# EAGLE design sensorboard1 (EAGLE 9.5.2)
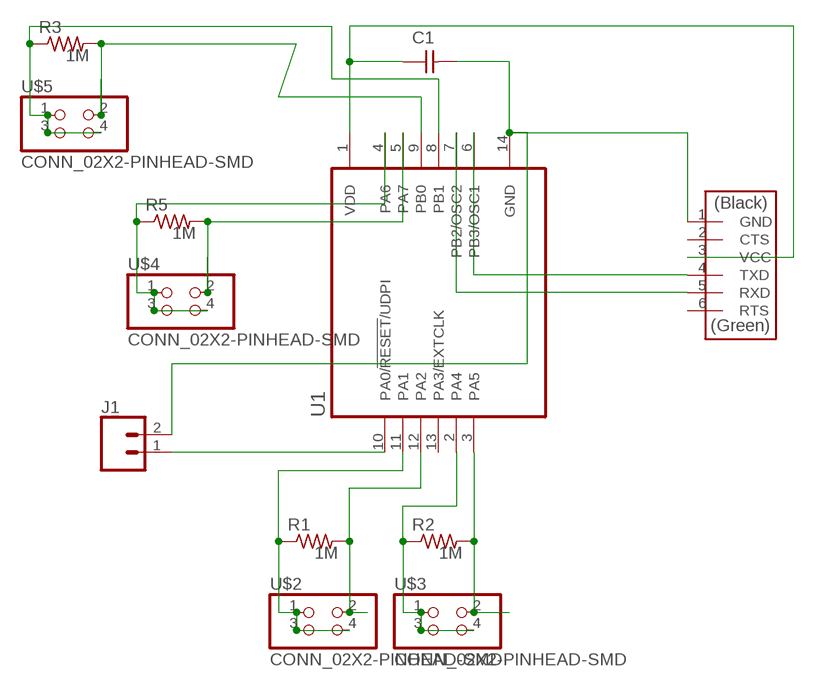
[diagram p0: schematic, sheet 1]

## Parts
C1  CAP_UNPOLARIZEDFAB  [C1206FAB]
J1  CONN_02LOCK_LONGPADS  [1X02_LOCK_LONGPADS]
R1  R1206FAB  [R1206FAB]
R2  R1206FAB  [R1206FAB]
R3  R1206FAB  [R1206FAB]
R5  R1206FAB  [R1206FAB]
U1  ATTINY1614-SSNR  [SOIC127P600X175-14N]
U$1  CONN_06_FTDI-SMD-HEADER  [1X06SMD]
U$2  CONN_02X2-PINHEAD-SMD  [2X02SMD]
U$3  CONN_02X2-PINHEAD-SMD  [2X02SMD]
U$4  CONN_02X2-PINHEAD-SMD  [2X02SMD]
U$5  CONN_02X2-PINHEAD-SMD  [2X02SMD]

## Nets
N$1: R1.2 U1.12(PA2) U$2.2
N$2: R1.1 U1.11(PA1) U$2.1 U$2.3 U$2.4
N$3: R2.2 U1.3(PA5) U$3.2
N$4: R2.1 U1.2(PA4) U$3.1 U$3.3 U$3.4
N$5: R5.2 U1.5(PA7) U$4.2
N$6: R5.1 U1.4(PA6) U$4.1 U$4.3 U$4.4
N$7: C1.2 J1.2 U1.14(GND) U$1.1(GND)
N$8: R3.2 U1.9(PB0) U$5.2
N$9: R3.1 U1.8(PB1) U$5.1 U$5.3 U$5.4
N$11: J1.1 U1.10(PA0/!RESET!/UDPI)
N$12: C1.1 U1.1(VDD) U$1.3(VCC)
N$13: U1.6(PB3/OSC1) U$1.4(TXD)
N$14: U1.7(PB2/OSC2) U$1.5(RXD)
Unconnected: U1.13(PA3/EXTCLK) U$1.2(CTS) U$1.6(RTS)

## Library data of the parts
C1 = fab_new:CAP_UNPOLARIZED
J1 = SparkFun-Connectors:CONN_02: Multi connection point. Often used as Generic Header-pin footprint for 0.1 inch spaced/style header connections On any of the 0.1 inch spaced packages, you can populate with these: Break Away Headers - Straight <https://www.sparkfun.com/products/116> (PRT-00116) Break Away Male Headers - Right Angle <https://www.sparkfun.com/products/553> (PRT-00553) Female Headers <https://www.sparkfun.com/products/115> (PRT-00115) Break Away Headers - Machine Pin <https://www.sparkfun.com/products/117> (PRT-00117) Break Away Female Headers - Swiss Machine Pin <https://www.sparkfun.com/products/743> (PRT-00743) For SCREWTERMINALS and SPRING TERMINALS visit here: Screw Terimnals on SparkFun.com <https://www.sparkfun.com/search/results?term=Screw+Terminals> (5mm/3.5mm/2.54mm spacing) This device is also useful as a general connection point to wire up your design to another part of your project. Our various solder wires solder well into these plated through hole pads. Hook-Up Wire - Assortment (Stranded, 22 AWG) <https://www.sparkfun.com/products/11375> (PRT-11375) Hook-Up Wire - Assortment (Solid Core, 22 AWG) <https://www.sparkfun.com/products/11367> (PRT-11367) View the entire wire category on our website here <https://www.sparkfun.com/categories/141> Special notes: Molex polarized connector foot print use with: PRT-08233 with associated crimp pins and housings. 2.54_SCREWTERM for use with PRT-10571. 3.5mm Screw Terminal footprints for PRT-08084 5mm Screw Terminal footprints for use with PRT-08432
R1-R3 R5 = fab_new:R: Resistor (US Symbol) Variants with postfix FAB are widened to allow the routing of internal traces; R1: 1M
U1 = ATTINY1614-SSNR:ATTINY1614-SSNR: 20MHz, SOIC, 85C, Green, 14 SOIC .150in T/R; AVAILABILITY: Unavailable; DESCRIPTION: AVR tinyAVR™ 1 Microcontroller IC 8-Bit 20MHz 16KB _16K x 8_ FLASH 14-SOIC; MF: Microchip; MP: ATTINY1614-SSNR; PACKAGE: SO-14 Microchip; PRICE: None
U$1 = fab_new:CONN_06_FTDI-SMD-HEADER
U$2-U$5 = fab_new:CONN_02X2-PINHEAD-SMD

## Board
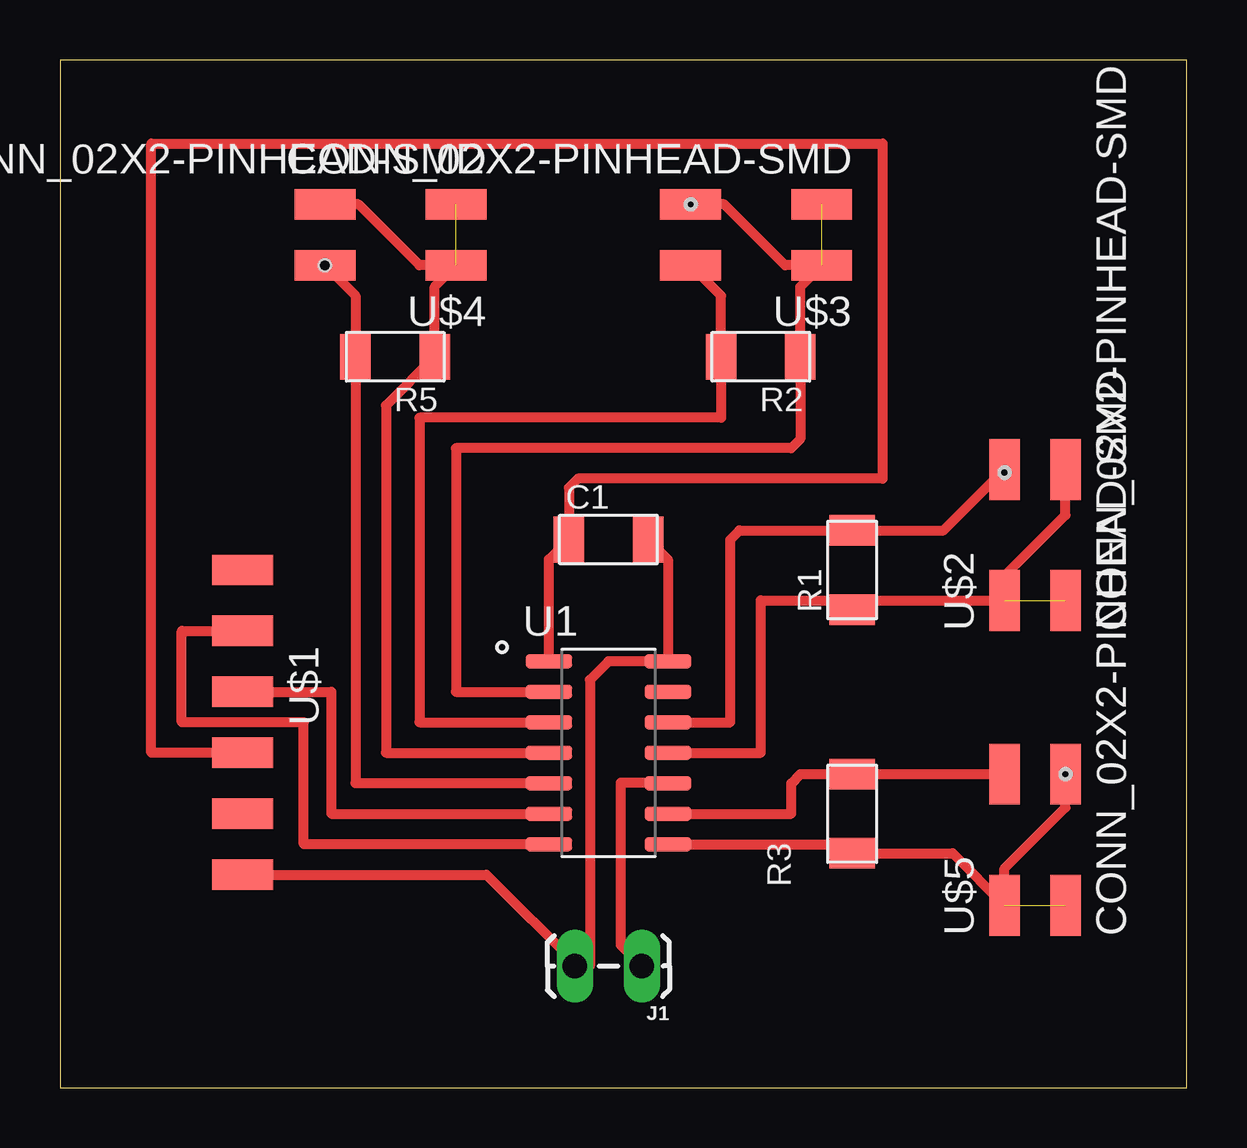
[diagram p1: board, top side]

Size 46.97 x 42.85 mm. Coordinates in mm from the lower left corner, seen from the top.
Outline: 0,0 46.97,0 46.97,42.85 0,42.85 0,0
Copper layers (1*16): Top 0.035mm / dielectric 1.5mm / Bottom 0.035mm
Design rules "default": minimum track width 6mil, minimum drill 0.35mm, track to track 6mil, track to pad 6mil, pad to pad 6mil, via to via 6mil, smd to smd 6mil, copper to edge 40mil, drill to drill 6mil, minimum pad ring 10mil, minimum via ring 8mil, stop-mask expansion 4mil, vias tented up to drill 0mil, thermal gap 10mil
Holes 0.35 mm at 26.29,36.83 39.37,25.65 41.91,13.08
Holes 0.51 mm at 11.05,34.29 26.29,36.83 39.37,25.65 41.91,13.08

### Footprints (pad centres in the part's own frame; a part is rotated, then mirrored left to right if it is on the bottom)
C1206FAB = smd 1.27 x 1.905: 1 -1.651,0; 2 1.651,0
1X02_LOCK_LONGPADS = drill 1.016 long: 1 -0.127,0; 2 2.667,0
R1206FAB = smd 1.27 x 1.905: 1 -1.651,0; 2 1.651,0
SOIC127P600X175-14N = smd 1.95 x 0.59: 1 -2.48,3.81; 2 -2.48,2.54; 3 -2.48,1.27; 4 -2.48,0; 5 -2.48,-1.27; 6 -2.48,-2.54; 7 -2.48,-3.81; 8 2.48,-3.81; 9 2.48,-2.54; 10 2.48,-1.27; 11 2.48,0; 12 2.48,1.27; 13 2.48,2.54; 14 2.48,3.81
1X06SMD = smd 2.54 x 1.27: 1 0,6.35; 2 0,3.81; 3 0,1.27; 4 0,-1.27; 5 0,-3.81; 6 0,-6.35
2X02SMD = smd 2.54 x 1.27: 1 -2.54,1.27; 2 2.92,1.27; 3 -2.54,-1.27; 4 2.92,-1.27

### Placement (x,y rotation side)
C1  22.86,22.86 0 top
J1  24.13,5.08 180 top
R1  33.02,21.59 90 top
R2  29.21,30.48 180 top
R3  33.02,11.43 90 top
R5  13.97,30.48 180 top
U1  22.86,13.97 0 top
U$1  7.62,15.24 180 top
U$2  40.64,22.86 90 top
U$3  29.21,35.56 180 top
U$4  13.97,35.56 180 top
U$5  40.64,10.16 90 top

### Tracks (layer width: path | path; a pad name or v marks a point on that pad's centre or on a via)
N$1
  Top 0.406: U1.12 27.94,15.24 27.94,22.86 28.32,23.24 R1.2 36.83,23.24 U$2.2
N$2  (1 unrouted)
  Top 0.406: U1.11 29.21,13.97 29.21,20.32 32.64,20.32 R1.1 33.4,20.32 U$2.1 39.37,21.34 41.91,23.88 U$2.4
N$3
  Top 0.406: U1.3 14.99,15.24 14.99,27.94 27.56,27.94 R2.2 27.56,33.02 U$3.2
N$4  (1 unrouted)
  Top 0.406: U1.2 16.51,16.51 16.51,26.67 30.48,26.67 30.86,27.05 R2.1 30.86,33.4 U$3.1 30.23,34.29 27.69,36.83 U$3.4
N$5
  Top 0.406: U1.5 12.32,12.7 R5.2 12.32,33.02 U$4.2
N$6  (1 unrouted)
  Top 0.406: U$4.4 12.45,36.83 14.99,34.29 U$4.1 15.62,33.4 R5.1 13.59,28.45 13.59,13.97 U1.4
N$7
  Top 0.406: C1.2 25.34,22.03 U1.14 22.86,17.78 22.09,17.01 22.09,5.08 21.59,5.08 | 21.59,5.08 J1.2 | U$1.1 17.78,8.89 21.59,5.08
N$8
  Top 0.406: U1.9 30.48,11.43 30.48,12.7 30.86,13.08 R3.2 U$5.2
N$9  (1 unrouted)
  Top 0.406: U1.8 32.64,10.16 R3.1 37.21,9.78 U$5.1 39.37,9.14 41.91,11.68 U$5.4
N$11
  Top 0.406: J1.1 23.37,5.96 23.37,12.72 25.32,12.72 U1.10
N$12
  Top 0.406: U1.1 20.38,22.03 C1.1 21.21,25.02 21.59,25.4 34.29,25.4 34.29,39.37 3.81,39.37 3.81,13.97 U$1.3
N$13
  Top 0.406: U$1.4 11.3,16.51 11.3,11.43 U1.6
N$14
  Top 0.406: U$1.5 5.08,19.05 5.08,15.24 10.16,15.24 10.16,10.16 U1.7